# EAGLE design BufferSaver (EAGLE 9.1.3)
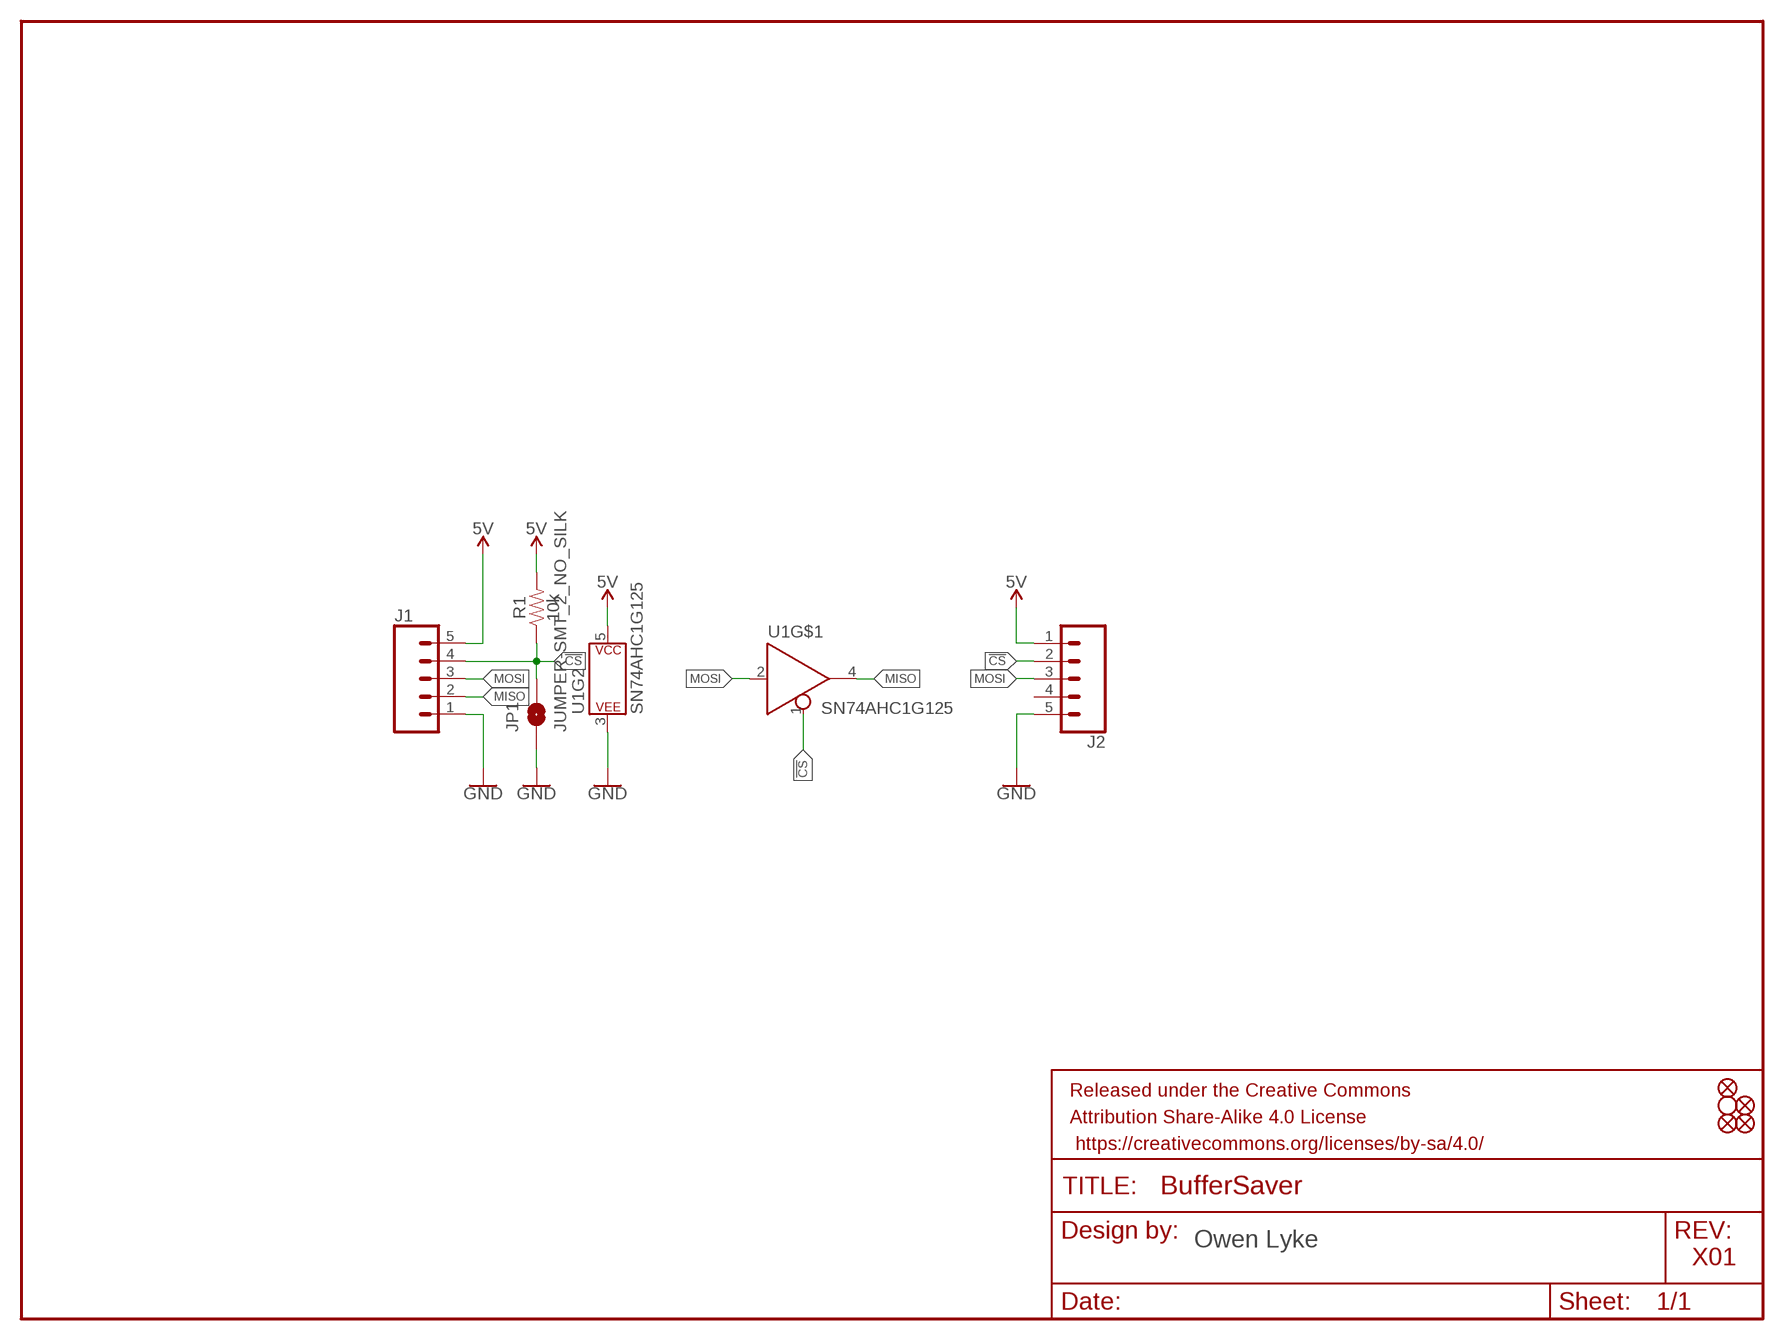
[diagram p0: schematic, sheet 1]

## Parts
FD1  FIDUCIAL1X2  [FIDUCIAL-1X2]
FD2  FIDUCIAL1X2  [FIDUCIAL-1X2]
FD3  FIDUCIAL1X2  [FIDUCIAL-1X2]
FD4  FIDUCIAL1X2  [FIDUCIAL-1X2]
FRAME1  FRAME-LETTER  [CREATIVE_COMMONS]
H2  STAND-OFF  [STAND-OFF]
J1  CONN_05NO_SILK  [1X05_NO_SILK]
J2  CONN_05NO_SILK  [1X05_NO_SILK]
JP1  JUMPER-SMT_2_NO_SILK  [SMT-JUMPER_2_NO_SILK]
R1  10k  10KOHM-0603-1/10W-1%  [0603]
U1  SN74AHC1G125  74AHC1G125D  [SOT23-5]

## Nets
5V: J1.5 J2.1 R1.2 U1.5(P$V+)
!CS: J1.4 J2.2 JP1.2 R1.1 U1.1(!EN)
GND: J1.1 J2.5 JP1.1 U1.3(P$V-)
MISO: J1.2 U1.4(Y)
MOSI: J1.3 J2.3 U1.2(A)
Unconnected: J2.4

## Notes on the sheet
- Owen Lyke
- X01

## Library data of the parts
FD1-FD4 = SparkFun-Aesthetics:FIDUCIAL: Fiducial Alignment Points Point-of-reference for pick-and-place machines and other optical instruments.
FRAME1 = SparkFun-Aesthetics:FRAME-LETTER: Schematic Frame - Letter Standard 8.5x11 US Letter frame
H2 = SparkFun-Hardware:STAND-OFF: Stand Off Drill holes for mechanically mounting via screws, standoffs, etc. Note: Use the keepout ring to avoid running the screw head into surrounding components. Variant Overviews STAND-OFF - Mechanical footprint for a #4 phillips button head screw. STAND-OFF-TIGHT - Mechanical footprint for a #4 phillips button head screw, Example SparkFun Products Screw - Phillips Head (1/4", 4-40, 10 pack) <https://www.sparkfun.com/products/10453> (PRT-10453) Screw - Phillips Head (1/2", 4-40, 10 pack) <https://www.sparkfun.com/products/10452> (PRT-10452) Screw - Phillips Head (3/4", 4-40, 10 pack) <https://www.sparkfun.com/products/10451> (PRT-10451) Screw - Phillips Head (1", 4-40, 10 pack) <https://www.sparkfun.com/products/10450> (PRT-10450)
J1 J2 = SparkFun-Connectors:CONN_05: Multi connection point. Often used as Generic Header-pin footprint for 0.1 inch spaced/style header connections On any of the 0.1 inch spaced packages, you can populate with these: Break Away Headers - Straight <https://www.sparkfun.com/products/116> (PRT-00116) Break Away Male Headers - Right Angle <https://www.sparkfun.com/products/553> (PRT-00553) Female Headers <https://www.sparkfun.com/products/115> (PRT-00115) Break Away Headers - Machine Pin <https://www.sparkfun.com/products/117> (PRT-00117) Break Away Female Headers - Swiss Machine Pin <https://www.sparkfun.com/products/743> (PRT-00743) For SCREWTERMINALS and SPRING TERMINALS visit here: Screw Terimnals on SparkFun.com <https://www.sparkfun.com/search/results?term=Screw+Terminals> (5mm/3.5mm/2.54mm spacing) This device is also useful as a general connection point to wire up your design to another part of your project. Our various solder wires solder well into these plated through hole pads. Hook-Up Wire - Assortment (Stranded, 22 AWG) <https://www.sparkfun.com/products/11375> (PRT-11375) Hook-Up Wire - Assortment (Solid Core, 22 AWG) <https://www.sparkfun.com/products/11367> (PRT-11367) View the entire wire category on our website here <https://www.sparkfun.com/categories/141> Special notes: Molex polarized connector foot print use with SKU : PRT-08231 with associated crimp pins and housings. 1MM SMD Version SKU: PRT-10208
JP1 = SparkFun-Jumpers:JUMPER-SMT_2_NO: Normally open jumper This jumper has two pads in close proximity to each other. Apply solder to close the connection. Round pads are easier to solder for beginners, but are a lot larger. SparkFun Product that uses the round pads: SparkFun EL Sequencer <https://www.sparkfun.com/products/12781>
R1 = SparkFun-Resistors:10KOHM: 10kΩ resistor A resistor is a passive two-terminal electrical component that implements electrical resistance as a circuit element. Resistors act to reduce current flow, and, at the same time, act to lower voltage levels within circuits. - Wikipedia; PROD_ID: RES-00824
U1 = SparkFun-IC-Logic:74*1G125: Single buffer Buffers & Line Drivers Tri-State Single Bus SOT-23-5 Datasheet SparkFun Products SparkFun SAMD21 Mini Breakout <https://www.sparkfun.com/products/13664> (DEV-13664) SparkFun SAMD21 Dev Breakout <https://www.sparkfun.com/products/13672> (DEV-13672) SparkFun MIDI Shield <https://www.sparkfun.com/products/12898> (DEV-12898) SparkFun WiFi Shield - CC3000 <https://www.sparkfun.com/products/12071> (DEV-12071); PROD_ID: IC-11920

## Board
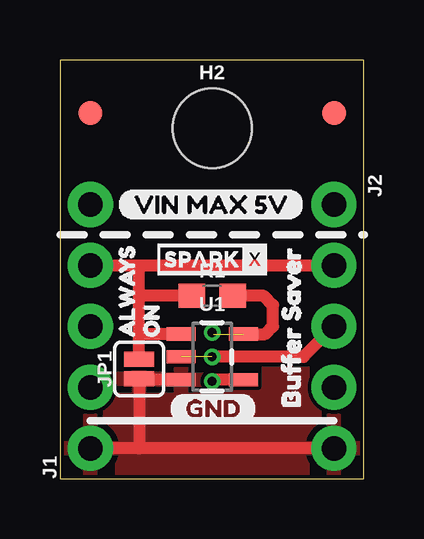
[diagram p1: board, top side]
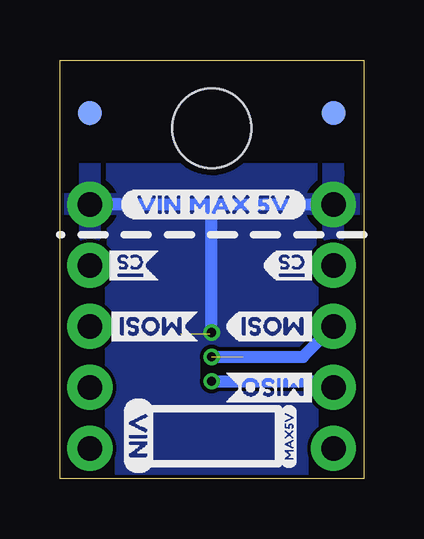
[diagram p2: board, bottom side, seen from below]

Size 12.68 x 17.45 mm. Coordinates in mm from the lower left corner, seen from the top.
Outline: 0,0 12.68,0 12.68,17.45 0,17.45 0,0
Copper layers (1*16): Top 0.035mm / dielectric 1.5mm / Bottom 0.035mm
Design rules "SparkFun-2-layer-PCBWay-LIMIT": minimum track width 6mil, minimum drill 0.3mm, track to track 6mil, track to pad 6mil, pad to pad 6mil, via to via 6mil, smd to smd 6mil, copper to edge 6mil, drill to drill 6mil, minimum pad ring 6mil, minimum via ring 6mil, stop-mask expansion 4mil, vias tented up to drill 25mil, thermal gap 10mil

### Footprints (pad centres in the part's own frame; a part is rotated, then mirrored left to right if it is on the bottom)
FIDUCIAL-1X2 = smd 1 x 1: 1 0,0
STAND-OFF = hole 3.302: 0,0
1X05_NO_SILK = drill 1.016 pad 1.88: 1 0,0; 2 2.54,0; 3 5.08,0; 4 7.62,0; 5 10.16,0
SMT-JUMPER_2_NO_SILK = smd 0.635 x 1.27: 1 -0.406,0; 2 0.406,0
0603 = smd 1.1 x 1: 1 -0.85,0; 2 0.85,0
SOT23-5 = smd 0.55 x 1.2: 1 -0.95,-1.3; 2 0,-1.3; 3 0.95,-1.3; 4 0.95,1.3; 5 -0.95,1.3

### Placement (x,y rotation side)
FD1  1.27,15.24 0 top
FD2  11.43,15.24 0 top
FD3  1.27,15.24 0 bottom
FD4  11.43,15.24 0 bottom
FRAME1  40.64,-11.43 0 top  (outside the outline)
H2  6.35,14.61 0 top
J1  1.27,1.27 90 top
J2  11.43,11.43 270 top
JP1  3.3,4.57 90 top
R1  6.35,7.62 0 top
U1  6.35,5.08 270 top
U$1  [#CS3]  1.65,8.89 180 bottom
U$2  [#CS4]  8.38,8.89 180 bottom
U$3  [VIN_MAX_5V11]  10.16,11.43 0 bottom
U$4  [BUFFER_SAVER7]  9.65,2.29 90 top
U$5  [GND5]  4.57,2.92 0 top
U$6  [MISO2]  1.78,3.81 180 bottom
U$7  [MAX5V8]  3.12,0.43 90 bottom
U$8  [MOSI0]  1.78,6.35 180 bottom
U$10  [MOSI1]  6.86,6.35 180 bottom
U$11  [ALWAYS9]  2.79,5.33 90 top
U$12  [VIN6]  9.4,3.43 270 bottom
U$13  [ON10]  3.81,5.33 90 top
U$14  [VIN_MAX_5V11]  2.41,11.43 0 top
U$34  SPARKX-LOGO2  [SPARKX-TINY]  6.35,9.14 0 top

### Tracks (layer width: path | path; a pad name or v marks a point on that pad's centre or on a via)
5V  (via drill 0.38)  (1 unrouted)
  Top 0.508: 6.42,6.03 v6.35,6.1 | R1.2 8.51,7.62 8.89,7.24 8.89,6.35 8.57,6.03 U1.5
  Bottom 0.508: 10.16,11.43 J2.1 6.35,11.43 | v6.35,6.1 6.35,11.43 | 6.35,11.43 J1.5
  pour Bottom: 0,12.7 12.7,12.7 12.7,0 0,0
!CS
  Top 0.508: J1.4 3.3,8.89 | 3.3,8.89 J2.2 | JP1.2 3.3,5.97 | 3.3,5.97 3.3,7.62 | 3.3,7.62 3.3,8.89 | 3.3,5.97 3.36,6.03 U1.1 | R1.1 3.3,7.62
GND
  Top 0.508: J2.5 3.3,1.27 | 3.3,1.27 J1.1 | 3.3,4.06 JP1.1 3.34,4.13 U1.3 | 3.3,4.06 3.3,1.27 | 3.37,4.13 3.3,4.06
  pour Top: 0,12.7 12.7,12.7 12.7,0 0,0
MISO  (via drill 0.38)
  Top 0.508: v6.35,4.06 6.42,4.13 U1.4
  Bottom 0.508: v6.35,4.06 1.52,4.06 J1.2
MOSI  (via drill 0.38)  (1 unrouted)
  Top 0.508: J2.3 10.16,5.08 v6.35,5.08
  Bottom 0.508: v6.35,5.08 2.54,5.08 J1.3